# EAGLE schematic test51 (EAGLE 8.6.3)

## Sheet 1 of 3
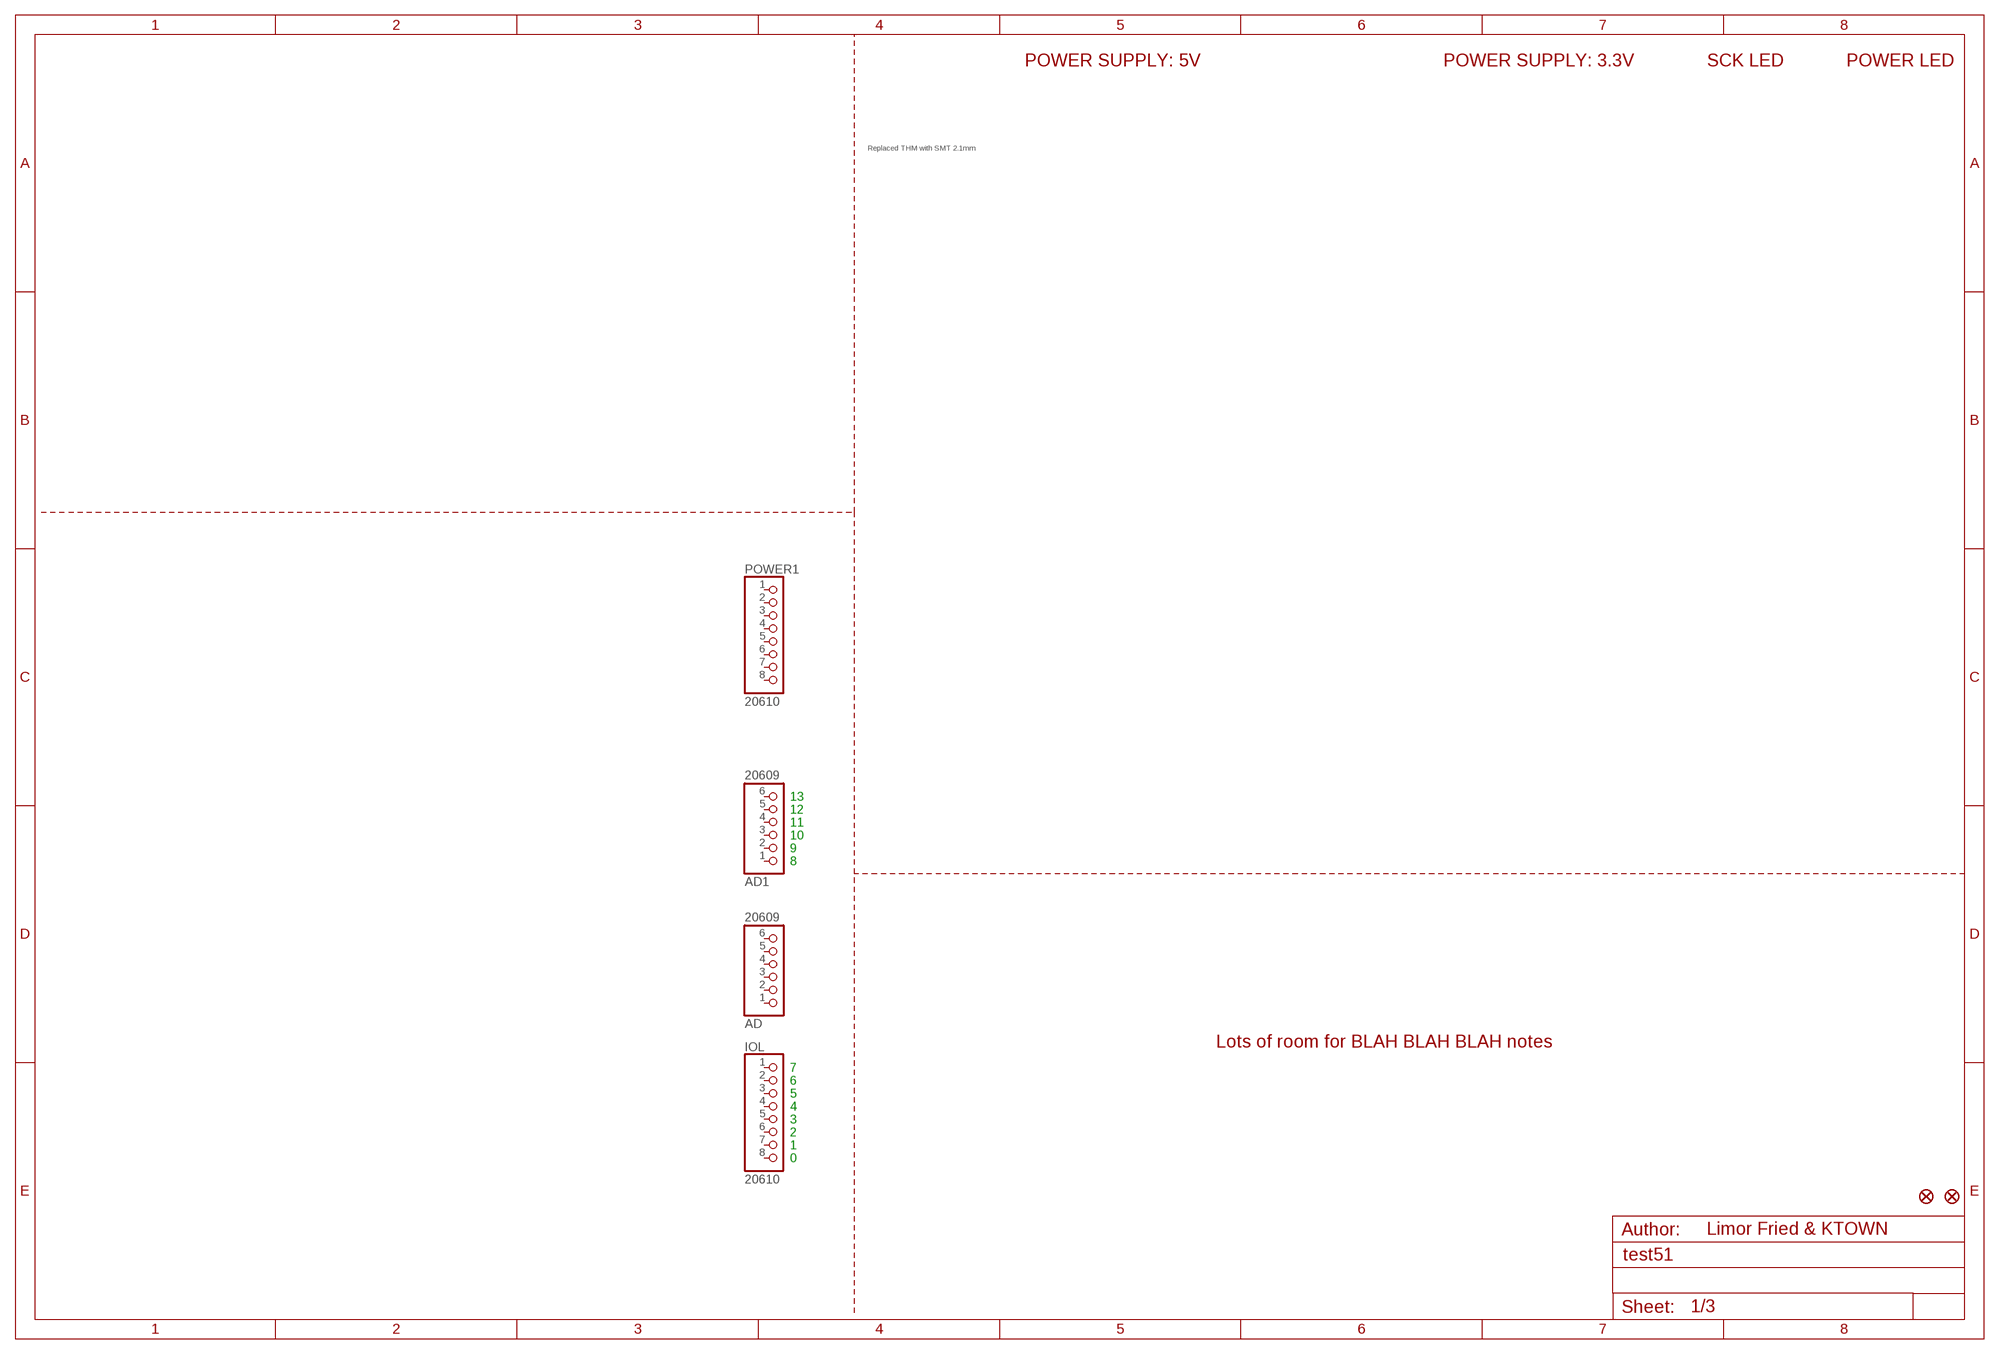
[diagram p0: schematic, sheet 1]

### Parts
AD  20609  HEADER-1X6ROUND  [1X06_ROUND]
AD1  20609  HEADER-1X6ROUND  [1X06_ROUND]
FD1  FIDUCIAL""  [FIDUCIAL_1MM]
FD2  FIDUCIAL""  [FIDUCIAL_1MM]
IOL  20610  HEADER-1X8ROUND  [1X08_ROUND]
POWER1  20610  HEADER-1X870MIL  [1X08_ROUND_70]
Unconnected: AD1.1 AD1.2 AD1.3 AD1.4 AD1.5 AD1.6 AD.1 AD.2 AD.3 AD.4 AD.5 AD.6 IOL.1 IOL.2 IOL.3 IOL.4 IOL.5 IOL.6 IOL.7 IOL.8 POWER1.1 POWER1.2 POWER1.3 POWER1.4 POWER1.5 POWER1.6 POWER1.7 POWER1.8

### Notes on the sheet
- POWER SUPPLY: 5V | POWER SUPPLY: 3.3V | SCK LED | POWER LED
- Replaced THM with SMT 2.1mm
- 13
- 12
- 11
- 10
- 9
- 8
- Lots of room for BLAH BLAH BLAH notes
- 7
- 6
- 5
- 4
- 3
- 2
- 1
- 0
- Limor Fried & KTOWN

## Sheet 2 of 3
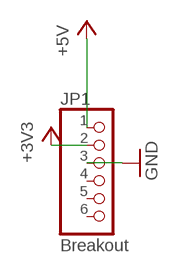
[diagram p1: schematic, sheet 2]

### Parts
JP1  Breakout  HEADER-1X676MIL  [1X06_ROUND_76]

### Nets
+3V3: JP1.2
+5V [usbvcc]: JP1.1
GND [gnd]: JP1.3
Unconnected: JP1.4 JP1.5 JP1.6

## Sheet 3 of 3
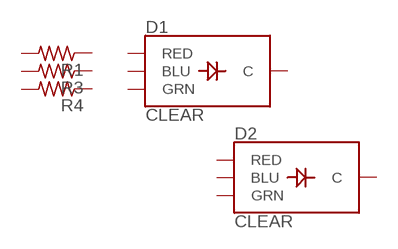
[diagram p2: schematic, sheet 3]

### Parts
D1  CLEAR  LED-RGB-CCCLEAR  [LED-RGB-THRU]
D2  CLEAR  LED-RGB-CCCLEAR  [LED-RGB-THRU]
R1  R-US_0309/12  [0309/12]
R3  R-US_0309/12  [0309/12]
R4  R-US_0309/12  [0309/12]
Unconnected: D1.1(RED) D1.2(C) D1.3(GRN) D1.4(BLU) D2.1(RED) D2.2(C) D2.3(GRN) D2.4(BLU) R1.1 R1.2 R3.1 R3.2 R4.1 R4.2

## Library data of the parts
AD AD1 JP1 = microbuilder:HEADER-1X6: PIN HEADER
D1 D2 = SparkFun-LED:LED-RGB-CC: LED-RGB Common Cathode Packages: LED RGB-THRU LED_PIRANHA_5MM SparkFun Products: RGB Diffused Common Cathode- Diffuse <[https://www.sparkfun.com/products/9264]> RGB Diffused Common Cathode - Clear <[https://www.sparkfun.com/products/105]> LED-RGB 5mm Square (Piranha) <[https://www.sparkfun.com/products/11679]>; PROD_ID: DIO-08418
FD1 FD2 = microbuilder:FIDUCIAL: Fiducial Alignment Points Various fiducial points for machine vision alignment.; BOM: EXCLUDE
IOL POWER1 = microbuilder:HEADER-1X8: PIN HEADER
R1 R3 R4 = resistor:R-US_: RESISTOR, American symbol

## Net classes
1 power: width 0.305 mm, drill 0.483 mm, clearance 0.203 mm
2 gnd: width 0.305 mm, drill 0.483 mm, clearance 0.203 mm
3 usbvcc: width 0.305 mm, drill 0.483 mm, clearance 0.203 mm
4 aref: width 0.254 mm, drill 0.483 mm, clearance 0.203 mm